# Altium schematic sheet MCU.SchDoc: Main Control Unit
size A4; DrawnBy: Robin Geißler; Revision: 1.0.; SheetNumber: 3; SheetTotal: 6
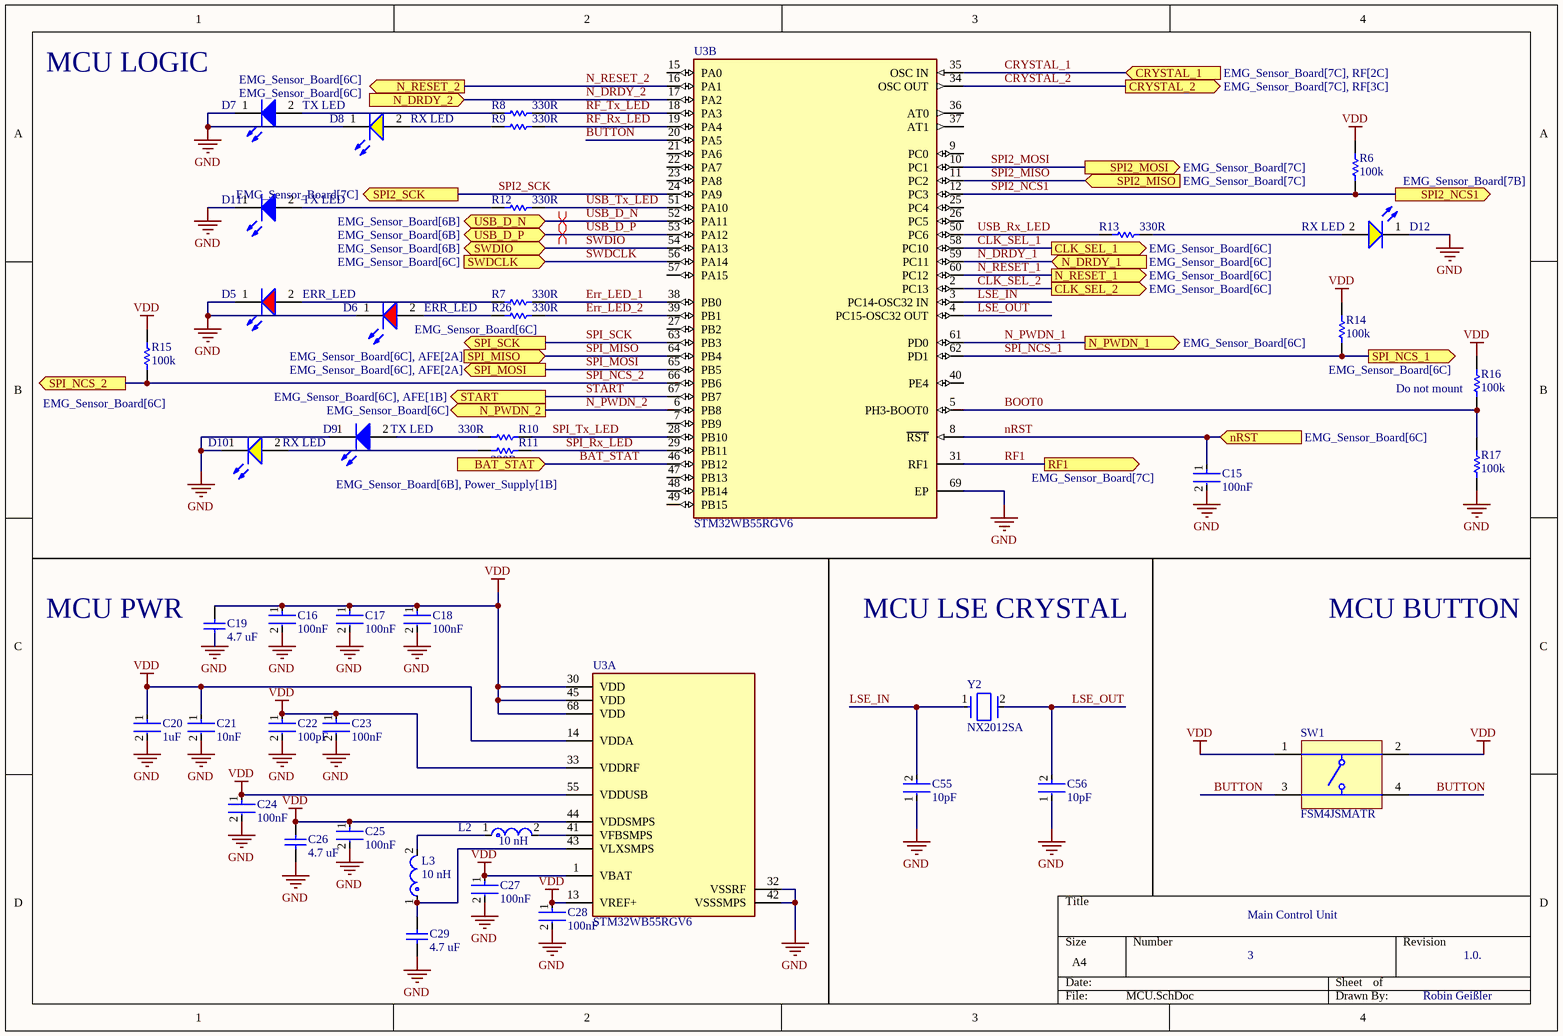
[diagram p0: MCU.SchDoc]

## Parts
C15  100nF  [FP-CGA3E-0_3-0_1-IPC_A]
C16  100nF  [FP-CGA3E-0_3-0_1-IPC_A]
C17  100nF  [FP-CGA3E-0_3-0_1-IPC_A]
C18  100nF  [FP-CGA3E-0_3-0_1-IPC_A]
C19  4.7 uF  [C-1608 [0603]-N]
C20  1uF  [FP-CGA3E-0_3-0_1-IPC_B]
C21  10nF  [FP-CC0603-DA-MFG]
C22  100pF  [FP-C0603C-CF-MFG]
C23  100nF  [FP-CGA3E-0_3-0_1-IPC_A]
C24  100nF  [FP-CGA3E-0_3-0_1-IPC_A]
C25  100nF  [FP-CGA3E-0_3-0_1-IPC_A]
C26  4.7 uF  [C-1608 [0603]-N]
C27  100nF  [FP-CGA3E-0_3-0_1-IPC_A]
C28  100nF  [FP-CGA3E-0_3-0_1-IPC_A]
C29  4.7 uF  [C-1608 [0603]-N]
C55  10pF  [FP-C1608-080-0_1-IPC_C]
C56  10pF  [FP-C1608-080-0_1-IPC_C]
D5  ERR_LED  [WL-SMCW_0603_150060xx75000]
D6  ERR_LED  [WL-SMCW_0603_150060xx75000]
D7  TX LED  [WL-SMCW_0603_150060xx75000]
D8  RX LED  [WL-SMCW_0603_150060xx75000]
D9  TX LED  [WL-SMCW_0603_150060xx75000]
D10  RX LED  [WL-SMCW_0603_150060xx75000]
D11  TX LED  [WL-SMCW_0603_150060xx75000]
D12  RX LED  [WL-SMCW_0603_150060xx75000]
L2  10 nH  [FP-LQG18HH_00-MFG]
L3  10 nH  [FP-LQG18HH_00-MFG]
R6  100k  [RESC1609X55X30ML10T20]
R7  330R  [RESC1608X55X30LL15T15]
R8  330R  [RESC1608X55X30LL15T15]
R9  330R  [RESC1608X55X30LL15T15]
R10  330R  [RESC1608X55X30LL15T15]
R11  330R  [RESC1608X55X30LL15T15]
R12  330R  [RESC1608X55X30LL15T15]
R13  330R  [RESC1608X55X30LL15T15]
R14  100k  [RESC1609X55X30ML10T20]
R15  100k  [RESC1609X55X30ML10T20]
R16  100k  [RESC1609X55X30ML10T20]
R17  100k  [RESC1609X55X30ML10T20]
R26  330R  [RESC1608X55X30LL15T15]
SW1  FSM4JSMATR  [TECO-FSM4JSMATR_V]
U3  STM32WB55RGV6  [FP-VFQFPN-68-B029-MFG]  (parts A,B of 2)
Y2  NX2012SA  [FP-NX2012SA-MFG]

## Ports
BAT_STAT (in, see EMG_Sensor_Board[6B], Power_Supply[1B]), CLK_SEL_1 (out, see EMG_Sensor_Board[6C]), CLK_SEL_2 (out, see EMG_Sensor_Board[6C]), CRYSTAL_1 (in, see EMG_Sensor_Board[7C], RF[2C]), CRYSTAL_2 (out, see EMG_Sensor_Board[7C], RF[3C]), N_DRDY_1 (in, see EMG_Sensor_Board[6C]), N_DRDY_2 (in, see EMG_Sensor_Board[6C]), N_PWDN_1 (out, see EMG_Sensor_Board[6C]), N_PWDN_2 (out, see EMG_Sensor_Board[6C]), N_RESET_1 (out, see EMG_Sensor_Board[6C]), N_RESET_2 (out, see EMG_Sensor_Board[6C]), nRST (in, see EMG_Sensor_Board[6C]), RF1 (out, see EMG_Sensor_Board[7C]), SPI2_MISO (in, see EMG_Sensor_Board[7C]), SPI2_MOSI (out, see EMG_Sensor_Board[7C]), SPI2_NCS1 (out, see EMG_Sensor_Board[7B]), SPI2_SCK (out, see EMG_Sensor_Board[7C]), SPI_MISO (in, see EMG_Sensor_Board[6C], AFE[2A]), SPI_MOSI (out, see EMG_Sensor_Board[6C], AFE[2A]), SPI_NCS_1 (out, see EMG_Sensor_Board[6C]), SPI_NCS_2 (out, see EMG_Sensor_Board[6C]), SPI_SCK (out, see EMG_Sensor_Board[6C]), START (out, see EMG_Sensor_Board[6C], AFE[1B]), SWDCLK (in, see EMG_Sensor_Board[6C]), SWDIO (bidir, see EMG_Sensor_Board[6B]), USB_D_N (bidir, see EMG_Sensor_Board[6B]), USB_D_P (bidir, see EMG_Sensor_Board[6B])

## Nets
GND: C15.2 C16.2 C17.2 C18.2 C19.1 C20.2 C21.2 C22.2 C23.2 C24.2 C25.2 C26.1 C27.2 C28.2 C29.1 C55.1 C56.1 D5.1(K) D6.1(K) D7.1(K) D8.1(K) D9.1(K) D10.1(K) D11.1(K) D12.1(K) R17.1 U3.32(VSSRF) U3.42(VSSSMPS) U3.69(EP)
VDD: C16.1 C17.1 C18.1 C19.2 C20.1 C21.1 C22.1 C23.1 C24.1 C25.1 C26.2 C27.1 C28.1 R6.2 R14.2 R15.2 R16.2 SW1.1 SW1.2 U3.1(VBAT) U3.13(VREF+) U3.14(VDDA) U3.30(VDD) U3.33(VDDRF) U3.44(VDDSMPS) U3.45(VDD) U3.55(VDDUSB) U3.68(VDD)
BAT_STAT: U3.46(PB12) ; port BAT_STAT
BOOT0: R16.1 R17.2 U3.5(PH3-BOOT0)
BUTTON: SW1.3 SW1.4 U3.20(PA5)
CLK_SEL_1: U3.58(PC10) ; port CLK_SEL_1
CLK_SEL_2: U3.2(PC13) ; port CLK_SEL_2
CRYSTAL_1: U3.35(OSC_IN) ; port CRYSTAL_1
CRYSTAL_2: U3.34(OSC_OUT) ; port CRYSTAL_2
Err_LED_1: R7.2 U3.38(PB0)
Err_LED_2: R26.2 U3.39(PB1)
LSE_IN: C55.2 U3.3(PC14-OSC32_IN) Y2.1
LSE_OUT: C56.2 U3.4(PC15-OSC32_OUT) Y2.2
N_DRDY_1: U3.59(PC11) ; port N_DRDY_1
N_DRDY_2: U3.17(PA2) ; port N_DRDY_2
N_PWDN_1: U3.61(PD0) ; port N_PWDN_1
N_PWDN_2: U3.6(PB8) ; port N_PWDN_2
N_RESET_1: U3.60(PC12) ; port N_RESET_1
N_RESET_2: U3.16(PA1) ; port N_RESET_2
nRST: C15.1 U3.8(~{RST}) ; port nRST
RF1: U3.31(RF1) ; port RF1
RF_Rx_LED: R9.2 U3.19(PA4)
RF_Tx_LED: R8.2 U3.18(PA3)
SPI2_MISO: U3.11(PC2) ; port SPI2_MISO
SPI2_MOSI: U3.10(PC1) ; port SPI2_MOSI
SPI2_NCS1: R6.1 U3.12(PC3) ; port SPI2_NCS1
SPI2_SCK: U3.24(PA9) ; port SPI2_SCK
SPI_MISO: U3.64(PB4) ; port SPI_MISO
SPI_MOSI: U3.65(PB5) ; port SPI_MOSI
SPI_NCS_1: R14.1 U3.62(PD1) ; port SPI_NCS_1
SPI_NCS_2: R15.1 U3.66(PB6) ; port SPI_NCS_2
SPI_Rx_LED: R11.1 U3.29(PB11)
SPI_SCK: U3.63(PB3) ; port SPI_SCK
SPI_Tx_LED: R10.1 U3.28(PB10)
START: U3.67(PB7) ; port START
SWDCLK: U3.56(PA14) ; port SWDCLK
SWDIO: U3.54(PA13) ; port SWDIO
USB_D_N: U3.52(PA11) ; port USB_D_N
USB_D_P: U3.53(PA12) ; port USB_D_P
USB_Rx_LED: R13.1 U3.50(PC6)
USB_Tx_LED: R12.2 U3.51(PA10)
NetC29_2: C29.2 L3.1 U3.43(VLXSMPS)
NetD5_2: D5.2(A) R7.1
NetD6_2: D6.2(A) R26.1
NetD7_2: D7.2(A) R8.1
NetD8_2: D8.2(A) R9.1
NetD9_2: D9.2(A) R10.2
NetD10_2: D10.2(A) R11.2
NetD11_2: D11.2(A) R12.1
NetD12_2: D12.2(A) R13.2
NetL2_1: L2.1 L3.2
NetL2_2: L2.2 U3.41(VFBSMPS)

Not connected (* = marked no-connect by the designer): U3 7(PB9) 9(PC0) 15(PA0) 21(PA6) 22(PA7) 23(PA8) 25(PC4) 26(PC5) 27(PB2) 36(AT0) 37(AT1) 40(PE4) 47(PB13) 48(PB14) 49(PB15) 57(PA15)

## Layout directives
differential pair: USB_D_N, USB_D_P

## Notes on the sheet
- MCU LOGIC
- (near R16) Do not mount
- MCU PWR
- MCU LSE CRYSTAL
- MCU BUTTON

## Library data of the parts
C15-C18 C23-C25 C27 C28 = CMP-2000-07546-2: Cap Ceramic 100nF 50V X7R 10% Pad SMD 0603 +125°C Automotive T/R; Weight: 7.1E-05oz; Composition: Ceramic; Max Operating Temperature: 125°C; Termination: SMD/SMT; Dielectric: X7R; Length: 1.6mm; Package Quantity: 1; REACH SVHC: No SVHC; Lead Free: Lead Free; Case Code (Metric): 1608; Min Operating Temperature: -55°C; Packaging: Tape and Reel; Tolerance: 10%; Voltage Rating: 50V; Case Code (Imperial): 0603; Capacitance: 100nF; Case/Package: 0603; Voltage Rating (DC): 50V; Depth: 0.8mm; Radiation Hardening: No; Ratings: AEC-Q200; Mount: Surface Mount; Voltage: 50V; Thickness: 0.035inch; Width: 0.8mm; Height: 0.8mm
C19 C26 C29 = C4u7_0603_C1608X5R1C475K080AE: CAP CER 0603 16V 4.70uF X5R 10%; Supplier 1: Mouser; Supplier Part Number 1: 810-C1608X5R1C475KE
C20 = CMP-08246-002551-1: Cap Ceramic 1uF 35V X7R 10% Pad SMD 0603 +125°C Automotive T/R; Termination: SMD/SMT; Packaging: Tape and Reel; Capacitance: 1uF; Tolerance: 10%; Mount: Surface Mount; Thickness: 0.035inch; Case Code (Imperial): 0603; Voltage Rating: 35V; Case/Package: 0603; Case Code (Metric): 1608; Dielectric: X7R; Width: 0.031inch; Length: 0.063inch; Min Operating Temperature: -55°C; Weight: 7.1E-05oz; Max Operating Temperature: 125°C; Voltage Rating (DC): 35V; Height: 0.8mm; Ratings: AEC-Q200; Package Quantity: 4000
C21 = CMP-2100-03600-2: CAP CER 10000PF 50V X7R 0603; Manufacturer Part Number: CC0603KRX7R9BB103; Manufacturer: YAGEO; Tolerance: 0.1; Material: Ceramic; Temperature Coefficient: 15%; Mouser Description: Multilayer Ceramic Capacitor, CC Series, 0.01 - F, - 10%, X7R, 50 V, 0603 [1608 Metric]; Digikey Description: CAP CER 10000PF 50V X7R 0603; Height: 0.9mm; Category: Cap; Temperature Characteristic: X7R; Footprint Url: http://www.yageo.com/exep/pages/download/literatures/UPY-C_GEN_24.pdf; Lead Free: Yes; Voltage Rating: 50 V; Temperature: -55°C to +125°C; Device Class L3: Ceramic Capacitors; ComponentLink2Description: Datasheet; Voltage: 50 V; Package: CC0603-DA; Octopart: https://octopart.com/cc0603krx7r9bb103-yageo-192938; Automotive: No; Temperature Range High: +125°C; Temperature Range Low: -55°C; Value: 10 nF; RoHS: TRUE; Device Class L1: Passive Components; ComponentLink2URL: http://www.yageo.com/documents/recent/UPY-GPHC_X7R_6.3V-to-50V_18.pdf; Device Class L2: Capacitors; Capacitance: 10 nF
C22 = CMP-2006-03408-2: CAP CER 100PF 50V C0G/NP0 0603; Manufacturer Part Number: C0603C101J5GACTU; Manufacturer: KEMET; Material: Ceramic; Tolerance: 0.05; Automotive Grade: Grade 1; Temperature Coefficient: 30ppm/°C; Temperature Characteristic: C0G; RoHS: TRUE; Temperature Range Low: -55°C; Automotive: Yes; Digikey Description: CAP CER 100PF 50V C0G/NP0 0603; Voltage Rating: 50 V; Lead Free: Yes; Category: Cap; Device Class L3: Ceramic Capacitors; Mouser Description: Multilayer Ceramic Capacitor, C Series, 100 Pf, - 5%, C0g / Np0, 50 V, 0603 [1608 Metric] Rohs Compliant: Yes; Value: 100 pF; Device Class L1: Passive Components; Temperature: -55°C to +125°C; ComponentLink2URL: https://api.kemet.com/component-edge/download/datasheet/C0603C100J5GACAUTO.pdf; Temperature Range High: +125°C; ComponentLink2Description: Datasheet; Octopart: https://octopart.com/c0603c101j5gactu-kemet-100052; Device Class L2: Capacitors; Height: 0.87mm; Capacitance: 100 pF; Package: C0603C-CF
C55 C56 = CMP-08246-005843-1: Multilayer Ceramic Capacitors 10pF ±0.5pF 50V C0G SMD 0603; Temperature Coefficient: 30ppm/°C; Tolerance: 5%; Termination: SMD/SMT; REACH SVHC: No SVHC; Package Quantity: 1; Case Code (Imperial): 0603; Number of Pins: 2; Capacitance: 10pF; Length: 1.6mm; Thickness: 0.037inch; Weight: 7.1E-05oz; Voltage Rating (DC): 50V; RoHS Compliant: Yes; Width: 0.031inch; Depth: 0.8mm; Case/Package: 0603; Dielectric Material: Ceramic; Voltage: 50V; Min Operating Temperature: -55°C; Case Code (Metric): 1608; Mount: Surface Mount; Height: 0.8mm; Construction: Flat; Series: C; Packaging: Tape and Reel; Radiation Hardening: No; Max Operating Temperature: 125°C; Lead Free: Lead Free; Voltage Rating: 50V; Dielectric: C0G
D5 D6 = CMP-1426-00001-3: NexarPartId: 29717776; Color: Red; Power Dissipation: 72mW; Max Reverse Voltage (DC): 5V; Peak Wavelength: 630nm; Viewing Angle: 140°; Forward Voltage: 2V; Luminous Intensity: 250mcd; Forward Current: 100mA; Dominant Wavelength: 625nm; Lens Style: Clear, Rectangular; Max Junction Temperature (Tj): 95°C; Test Current: 20mA; Mount: Surface Mount; Packaging: Tape and Reel; Case Code (Metric): 1608; Max Operating Temperature: 85°C; Case Code (Imperial): 0603; REACH SVHC: Unknown; Width: 800µm; Length: 1.6mm; Reverse Voltage: 5V; Height: 700µm; Case/Package: 0603; RoHS: Compliant; Wavelength: 625nm; Min Operating Temperature: -40°C
D7 D9 D11 = CMP-1426-00003-3: NexarPartId: 29717775; Luminous Intensity: 145mcd; Test Current: 20mA; Max Junction Temperature (Tj): 95°C; Max Reverse Voltage (DC): 5V; Dominant Wavelength: 470nm; Power Dissipation: 105mW; Peak Wavelength: 465nm; Forward Voltage: 3.2V; Viewing Angle: 140°; Color: Blue; Forward Current: 100mA; Lens Style: Clear, Rectangular; Mount: Surface Mount; Packaging: Tape and Reel; Min Operating Temperature: -40°C; Length: 1.6mm; Max Operating Temperature: 85°C; Width: 800µm; REACH SVHC: Unknown; Height: 700µm; Case Code (Imperial): 0603; RoHS: Compliant; Case/Package: 0603; Case Code (Metric): 1608; Wavelength: 470nm; Reverse Voltage: 5V
D8 D10 D12 = CMP-1426-00005-2: NexarPartId: 29687085; Wavelength: 590nm; Luminous Intensity: 120mcd; Peak Wavelength: 595nm; Forward Current: 100mA; Power Dissipation: 72mW; Color: Yellow; Forward Voltage: 2V; Test Current: 20mA; Reverse Voltage: 5V; Lens Style: Clear, Rectangular; Max Junction Temperature (Tj): 95°C; Viewing Angle: 140°; Case Code (Imperial): 0603; Height: 700µm; REACH SVHC: Unknown; Dominant Wavelength: 590nm; Min Operating Temperature: -40°C; Width: 800µm; Mount: Surface Mount; Packaging: Tape and Reel; Max Operating Temperature: 85°C; RoHS: Compliant; Max Reverse Voltage (DC): 5V; Case Code (Metric): 1608; Length: 1.6mm; Case/Package: 0603
L2 L3 = CMP-06042-004616-1: Multilayer type RF Inductor 10nH ±5% 0.3Ω 650mA 0603; Test Frequency: 100MHz; Current: 35mA; DC Resistance (DCR): 300mR; Q Factor: 12; DC Current: 400mA; Self Resonant Frequency: 3.5GHz; Core Material: Air; Shielding: Unshielded; Radiation Hardening: No; Case Code (Metric): 1608; Min Operating Temperature: -40°C; Inductance: 10nH; Inductance Tolerance: 5%; Case Code (Imperial): 0603; Termination: SMD/SMT; Height: 0.8mm; Packaging: Tape and Reel; Width: 0.031inch; Military Standard: Not; Max DC Current: 400mA; Max Operating Temperature: 85°C; Package Quantity: 4000; Depth: 0.95mm; Lead Free: Lead Free; Current Rating: 400mA; Mount: Surface Mount; Tolerance: 5%; Case/Package: 0603; REACH SVHC: No SVHC; Length: 1.6mm
R6 R14-R17 = CMP-2000-03685-1: TNPW0603100KBEEA; Manufacturer: Vishay Dale; Part Number: TNPW0603100KBEEA
R7-R13 R26 = CMP-2000-00435-2: Chip Resistor, 330 Ohm, +/- 1%, 0.1 W, -55 to 155 degC, 0603 (1608 Metric), RoHS, Tape and Reel; Gender: Male; Mating Cycles: 10000; Current Rating: 500 mA; Voltage Rating: 10 V; REACH SVHC: No SVHC; PackageDescription: 2-Pin Surface Mount Device, Body 1.6 x 0.85 mm; Contact Finish: Gold; Pins: 8; ComponentLink1Description: Manufacturer URL; Packaging: Tape and Reel; Max Operating Temperature: 85 degC; Contact Material: Copper; Height: 1.45 mm; Width: 1.45 mm; DatasheetVersion: Apr-15; Package Quantity: 1500; Contact Plating: Gold; PackageReference: 0603; Mount: Surface Mount; Lead Pitch: 1.1 mm; Min Operating Temperature: -25 degC; ComponentLink1URL: http://www.panasonic.com/; ComponentLink2URL: http://industrial.panasonic.com/cdbs/www-data/pdf/RDA0000/AOA0000C86.pdf; Length: 13.7 mm; ComponentLink2Description: Datasheet; RoHSCompliant: true
SW1 = CMP-2000-07486-1: Micro Miniature Push Button Switch FSM JSM, 50 mA, -35 to 85 degC, 4-Pin SMD, RoHS, Tape and Reel; Manufacturer: TE Connectivity; Mechanical Life: 100000Cycles; Current Rating: 50mA; Actuator Material: Polyamide; Max Voltage Rating (DC): 12V; Capacitance: 0f; Illumination Type: Illuminated; Voltage Rating (DC): 24V; Case\/Package: SMD/SMT; Operating Force: 160gf; Contact Resistance: 100mOhm; Actuator Length: 0.055inch; Switch Travel: 0.25mm; Throw Configuration: SPST; Termination: GullWing; Contact Plating: Silver; Orientation: Straight; Mounting Technology: SurfaceMount; REACH SVHC: Unknown; Electrical Life: 100000Cycles; Package Reference: FSM4JSMATR; Max Operating Temperature: 85degC; Manufacturer URL: http://www.te.com/; Package Description: 4-Pin Surface Mount Device, Body 6 x 6 mm, Pitch 4.5 mm; Datasheet Version: Rev. V, 02/2015; Packaging: TapeandReel; Min Operating Temperature: -35degC; Mount: SurfaceMount; Contact Current Rating: 50mA; Contact Material: CopperAlloy; Package Quantity: 1200; Datasheet URL: http://www.te.com/commerce/DocumentDelivery/DDEController?Action=showdoc&DocId=Customer+Drawing%7F2-1437565-7%7FV%7Fpdf%7FEnglish%7FENG_CD_2-1437565-7_V.pdf%7F4-1437565-2; RoHSCompliant: true
U3 = CMP-12160-000001-1: ULTRA-LOW-POWER DUAL CORE ARM CO; Manufacturer: STMicroelectronics; Max Junction Temp: +125°C; Bandwidth: 75MHz; Max Frequency: 2480MHz; Sensitivity: -96dBm; Number Of Adc Channels: 19; Receiving Current: 4.5-7.9mA; Interface: I2C,SPI,UART,USART,USB; Data Rate: 2Mbits/s; Number Of Gpio: 49; Min Supply Voltage: 1.71V; Max Power Dissipation: 425mW; Max Supply Voltage: 3.6V; Standoff Height: 0mm; Octopart: https://octopart.com/stm32wb55rgv6-stmicroelectronics-98750848; Category: IC; Digikey Description: ULTRA-LOW-POWER DUAL CORE ARM CO; Height: 1mm; Device Class L2: RF Semiconductors and Devices; Automotive: No; Ambient Temperature Range High: +105°C; ComponentLink2Description: Datasheet; Ambient Temperature Range Low: -40°C; Lead Free: Yes; Temperature Range Low: -40°C; Ipc Land Pattern Name: QFN40P800X800X90-68; Device Class L1: Integrated Circuits (ICs); Manufacturer Part Number: STM32WB55RGV6; Package: VFQFPN-68-B029; RoHS: TRUE; Temperature Range High: +125°C; ComponentLink2URL: https://www.st.com/resource/en/datasheet/stm32wb55rg.pdf; Temperature: -40°C to +125°C; Device Class L3: Transceivers; Mouser Description: MCU 32-Bit STM32WB55 ARM Cortex M4 RISC 1MB Flash 1.7V to 3.6V 68-Pin VFQFPN Tray
Y2 = CMP-200220-000019-1: CRYSTAL 32.7680KHZ 12.5PF SMD; Frequency Tolerance: 20ppm; ESR (Equivalent Series Resistance): 80kR; Frequency: 32.768kHz; Mount: Surface Mount; Packaging: Cut Tape; Min Operating Temperature: -40°C; Max Operating Temperature: 85°C; Case/Package: SMD/SMT; RoHS Compliant: Yes; Length: 0.081inch; Series: NX2012SA; Height: 0.024inch; Width: 0.047inch; Load Capacitance: 12.5pF